# Altium schematic sheet Curiosity_Nano_Base_for_Clicks.SchDoc: Curiosity Nano Base for Click boards
size A3; Organization: Microchip Technology Norway; Address1: Brøsetvegen 164; Address2: 7069 Trondheim; Address3: NORWAY; SheetNumber: 2; SheetTotal: 3; DrawnBy: M. Loper/T.Frostad; PageSetup: Record=PageOptions|CenterHorizontal=True|CenterVertical=True|PrintScale=1.01|XCorrection=1.00|YCorrection=1.00|PrintKind=1|BorderSize=5000000|LeftOffset=0|BottomOffset=0|Orientation=2|PaperLength=1000|PaperWidth=1000|Scale=100|PaperSource=7|PrintQuality=-4|MediaType=1|DitherType=10|PaperKind=A3 (297 x 420 mm)|PrintScaleMode=1; ProjectTitle: Curiosity Nano Base for Click boards
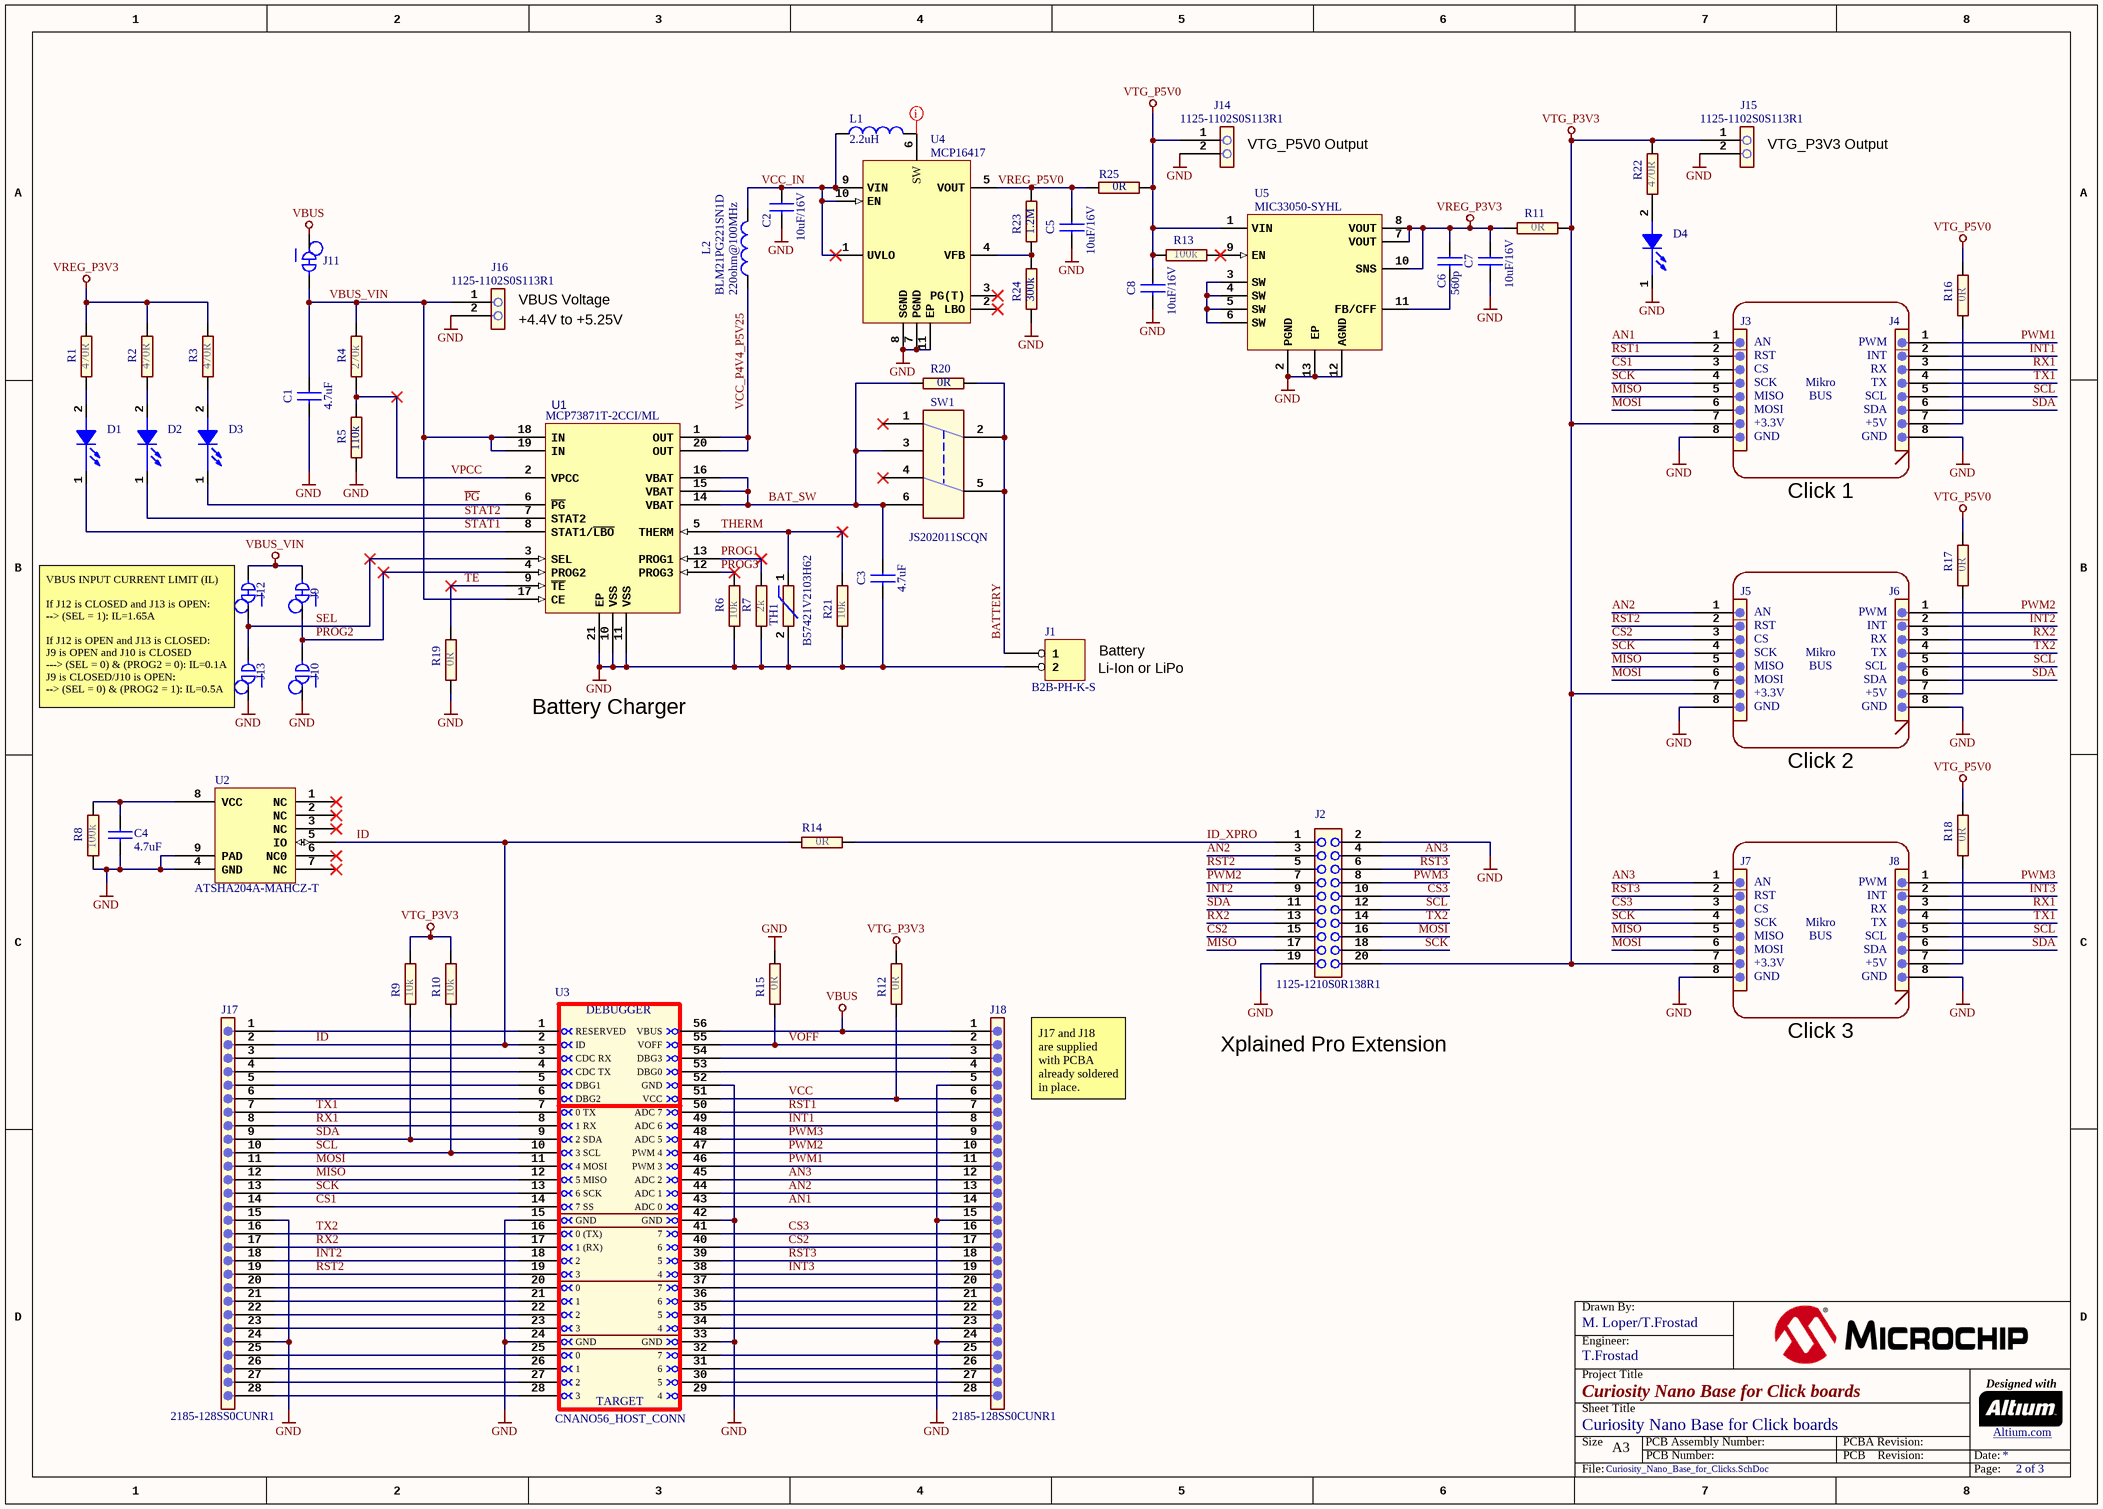
[diagram p0: Curiosity_Nano_Base_for_Clicks.SchDoc]

## Parts
C1  value 4.7uF  [AP1-00069]
C2  value 10uF/16V  [AP1-00039]
C3  value 4.7uF  [AP1-00069]
C4  value 4.7uF  [AP1-00069]
C5  value 10uF/16V  [AP1-00039]
C6  value 560p  [AP1-00002]
C7  value 10uF/16V  [AP1-00039]
C8  value 10uF/16V  [AP1-00039]
D1  (no value)  [AP4-00017]
D2  Farnell no. 1652078  [AP4-00017]  (value not drawn)
D3  Farnell no. 1652078  [AP4-00017]  (value not drawn)
D4  Farnell no. 1652078  [AP4-00017]  (value not drawn)
J1  value B2B-PH-K-S  [AP8-01010]
J2  value 1125-1210S0R138R1  [AP8-01078]
J3  (no value)  [AP8-01081]
J4  (no value)  [AP8-01081]
J5  (no value)  [AP8-01081]
J6  (no value)  [AP8-01081]
J7  (no value)  [AP8-01081]
J8  (no value)  [AP8-01081]
J9  (no value)  [AP9-00044]  (net tie, no BOM)
J10  (no value)  [AP9-00043]  (net tie, no BOM)
J11  (no value)  [AP9-00044]  (net tie, no BOM)
J12  (no value)  [AP9-00044]  (net tie, no BOM)
J13  (no value)  [AP9-00043]  (net tie, no BOM)
J14  value 1125-1102S0S113R1  [AP8-01074]
J15  value 1125-1102S0S113R1  [AP8-01074]
J16  value 1125-1102S0S113R1  [AP8-01074]
J17  value 2185-128SS0CUNR1  [AP8-01199]
J18  value 2185-128SS0CUNR1  [AP8-01199]
L1  value 2.2uH  [AP3-00165]
L2  value 220ohm@100MHz  MPN: BLM21PG221SN1D  [AP3-00104]
R1  value 470R  [AP2-00000]
R2  value 470R  [AP2-00000]
R3  value 470R  [AP2-00000]
R4  value 270k  [AP2-00000]
R5  value 110k  [AP2-00000]
R6  value 10k  [AP2-00000]
R7  value 2k  [AP2-00000]
R8  value 100k  [AP2-00000]
R9  value 10k  [AP2-00000]
R10  value 10k  [AP2-00000]
R11  value 0R  [AP2-00000]
R12  value 0R  [AP2-00000]
R13  value 100k  [AP2-00000]
R14  value 0R  [AP2-00000]
R15  value 0R  [AP2-00000]
R16  value 0R  [AP2-00000]
R17  value 0R  [AP2-00000]
R18  value 0R  [AP2-00000]
R19  value 0R  [AP2-00000]
R20  value 0R  [AP2-00001]
R21  value 10k  [AP2-00000]
R22  value 470R  [AP2-00000]
R23  value 1.2M  [AP2-00011]
R24  value 300k  [AP2-00011]
R25  value 0R  [AP3-00104]
SILK1  (no value)  [AP9-00167]
SILK2  (no value)  [AP9-00167]
SILK3  (no value)  [AP9-00167]
SW1  value JS202011SCQN  [AP8-00684]
TH1  MPN: B57421V2103H62  [AP2-00034]
U1  MPN: MCP73871T-2CCI/ML  [AP6-00165]
U2  MPN: ATSHA204A-MAHCZ-T  [AP6-00409]
U3  value CNANO56_HOST_CONN  [AP8-01154]  (no BOM)
U4  value MCP16417  [AP6-00560]
U5  value MIC33050-SYHL  [AP6-00528]

## Nets
GND: C1.2 C2.2 C3.2 C4.2 C5.2 C7.2 C8.2 D4.1(CATHODE) J1.2 J2.2 J2.19 J3.8 J4.8 J5.8 J6.8 J7.8 J8.8 J10.1 J13.1 J14.2 J15.2 J16.2 J17.15 J17.24 J18.5 J18.15 J18.24 R5.1 R6.2 R7.2 R8.2 R15.2 R19.2 R21.2 R24.1 TH1.2 U1.10(VSS) U1.11(VSS) U1.21(EP) U2.4(GND) U2.9(PAD) U3.0(GND) U3.15(GND) U3.24(GND) U3.33(GND) U3.42(GND) U3.52(GND) U4.7(PGND) U4.8(SGND) U4.11(EP) U5.2(PGND) U5.12(AGND) U5.13(EP)
VBUS: J11.1 J18.1 U3.56(VBUS)
VBUS_VIN: C1.1 J9.2 J11.2 J12.2 J16.1 R4.1 U1.17(CE) U1.18(IN) U1.19(IN)
VREG_P3V3: C6.1 C7.1 R1.1 R2.1 R3.1 R11.2 U5.7(VOUT) U5.8(VOUT) U5.10(SNS)
VTG_P3V3: J2.20 J3.7 J5.7 J7.7 J15.1 R9.1 R10.1 R11.1 R12.2 R22.1
VTG_P5V0: C8.1 J14.1 R13.1 R16.1 R17.1 R18.1 R25.2 U5.1(VIN)
AN1: J3.1 J18.14 U3.43(ADC_0)
AN2: J2.3 J5.1 J18.13 U3.44(ADC_1)
AN3: J2.4 J7.1 J18.12 U3.45(ADC_2)
BAT_SW: C3.1 R20.1 SW1.3(NC2) SW1.6(NC1) U1.14(VBAT) U1.15(VBAT) U1.16(VBAT)
BATTERY: J1.1 R20.2 SW1.2(COMMON2) SW1.5(COMMON1)
CS1: J3.3 J17.14 U3.14(7_SS)
CS2: J2.15 J5.3 J18.17 U3.40(6)
CS3: J2.10 J7.3 J18.16 U3.41(7)
ID: J17.2 R14.1 U2.5(IO) U3.2(ID)
ID_XPRO: J2.1 R14.2
INT1: J4.2 J18.8 U3.49(ADC_6)
INT2: J2.9 J6.2 J17.18 U3.18(2)
INT3: J8.2 J18.19 U3.38(4)
MISO: J2.17 J3.5 J5.5 J7.5 J17.12 U3.12(5_MISO)
MOSI: J2.16 J3.6 J5.6 J7.6 J17.11 U3.11(4_MOSI)
~{PG}: D3.1(CATHODE) U1.6(~{PG})
PROG1: R7.1 U1.13(PROG1)
PROG2: J9.1 J10.2 U1.4(PROG2)
PROG3: R6.1 U1.12(PROG3)
PWM1: J4.1 J18.11 U3.46(PWM_3)
PWM2: J2.7 J6.1 J18.10 U3.47(PWM_4)
PWM3: J2.8 J8.1 J18.9 U3.48(ADC_5)
RST1: J3.2 J18.7 U3.50(ADC_7)
RST2: J2.5 J5.2 J17.19 U3.19(3)
RST3: J2.6 J7.2 J18.18 U3.39(5)
RX1: J4.3 J8.3 J17.8 U3.8(1_RX)
RX2: J2.13 J6.3 J17.17 U3.17(1_(RX))
SCK: J2.18 J3.4 J5.4 J7.4 J17.13 U3.13(6_SCK)
SCL: J2.12 J4.5 J6.5 J8.5 J17.10 R10.2 U3.10(3_SCL)
SDA: J2.11 J4.6 J6.6 J8.6 J17.9 R9.2 U3.9(2_SDA)
SEL: J12.1 J13.2 U1.3(SEL)
STAT1: D1.1(CATHODE) U1.8(STAT1/~{LBO})
STAT2: D2.1(CATHODE) U1.7(STAT2)
~{TE}: R19.1 U1.9(~{TE})
THERM: R21.1 TH1.1 U1.5(THERM)
TX1: J4.4 J8.4 J17.7 U3.7(0_TX)
TX2: J2.14 J6.4 J17.16 U3.16(0_(TX))
VCC: J18.6 R12.1 U3.51(VCC)
VCC_IN: C2.1 L1.1 L2.2 U4.1(UVLO) U4.9(VIN) U4.10(EN)
VCC_P4V4_P5V25: L2.1 U1.1(OUT) U1.20(OUT)
VOFF: J18.2 R15.1 U3.55(VOFF)
VPCC: R4.2 R5.2 U1.2(VPCC)
VREG_P5V0: C5.1 R23.2 R25.1 U4.5(VOUT)
NetC4_1: C4.1 R8.1 U2.8(VCC)
NetC6_2: C6.2 U5.11(FB/CFF)
NetD1_2: D1.2(ANODE) R1.2
NetD2_2: D2.2(ANODE) R2.2
NetD3_2: D3.2(ANODE) R3.2
NetD4_2: D4.2(ANODE) R22.2
NetJ4_7: J4.7 R16.2
NetJ6_7: J6.7 R17.2
NetJ8_7: J8.7 R18.2
NetJ17_1: J17.1 U3.1(RESERVED)
NetJ17_3: J17.3 U3.3(CDC_RX)
NetJ17_4: J17.4 U3.4(CDC_TX)
NetJ17_5: J17.5 U3.5(DBG1)
NetJ17_6: J17.6 U3.6(DBG2)
NetJ17_20: J17.20 U3.20(0)
NetJ17_21: J17.21 U3.21(1)
NetJ17_22: J17.22 U3.22(2)
NetJ17_23: J17.23 U3.23(3)
NetJ17_25: J17.25 U3.25(0)
NetJ17_26: J17.26 U3.26(1)
NetJ17_27: J17.27 U3.27(2)
NetJ17_28: J17.28 U3.28(3)
NetJ18_3: J18.3 U3.54(DBG3)
NetJ18_4: J18.4 U3.53(DBG0)
NetJ18_20: J18.20 U3.37(7)
NetJ18_21: J18.21 U3.36(6)
NetJ18_22: J18.22 U3.35(5)
NetJ18_23: J18.23 U3.34(4)
NetJ18_25: J18.25 U3.32(7)
NetJ18_26: J18.26 U3.31(6)
NetJ18_27: J18.27 U3.30(5)
NetJ18_28: J18.28 U3.29(4)
NetL1_2: L1.2 U4.6(SW)
NetR13_2: R13.2 U5.9(EN)
NetR23_1: R23.1 R24.2 U4.4(VFB)
NetU5_3: U5.3(SW) U5.4(SW) U5.5(SW) U5.6(SW)

Not connected (* = marked no-connect by the designer): SW1 1(NO2)* 4(NO1)*; U2 1(NC)* 2(NC)* 3(NC)* 6(NC0)* 7(NC)*; U4 2(LBO)* 3(PG(T))*

## Layout directives
rule Assembly Testpoint Usage [Testpoint - Not Allowed    Multiple - Not Allowed]: NetL1_2

## Notes on the sheet
- (near J14) VTG_P5V0 Output
- (near J15) VTG_P3V3 Output
- (near J16) VBUS Voltage
- (near J16) +4.4V to +5.25V
- Click 1
- VBUS INPUT CURRENT LIMIT (IL)
  If J12 is CLOSED and J13 is OPEN:
  --> (SEL = 1): IL=1.65A
  If J12 is OPEN and J13 is CLOSED:
  J9 is OPEN and J10 is CLOSED
  ---> (SEL = 0) & (PROG2 = 0): IL=0.1A
  J9 is CLOSED/J10 is OPEN:
  --> (SEL = 0) & (PROG2 = 1): IL=0.5A
- Battery Charger
- (near J1) Li-Ion or LiPo
- Battery
- Click 2
- Xplained Pro Extension
- Click 3
- (near J18) J17 and J18
  are supplied
  with PCBA
  already soldered
  in place.
- Drawn By:
- Project Title
- Engineer:
- T.Frostad
- Designed with
- Sheet Title
- Size
- A3
- PCB Number:
- PCB Assembly Number:
- PCBA Revision:
- PCB    Revision:
- Date:
- Altium.com <http://go.altium.com/MicrochipLandingPage_Evaluation.html>
- File:
- Page:
- (in symbol A08-2847) AN; PWM; RST; INT; CS; RX; SCK; Mikro; TX; MISO; BUS; SCL; MOSI; SDA; +3.3V; +5V; GND
- (in symbol A08-2940) DEBUGGER; TARGET

## Library data of the parts
C1 C3 C4 = A01-0486: Ceramic capacitor, SMD 0805, X7R, 16V, 10%,; PartGroup: Capacitors,Ceramic,SMD 0805; Manufacturer: Yageo; MPN: CC0805KKX7R7BB475; TemperatureRange: -55 to +125 deg C; AN: A01-0486; Tolerance: 10%
C2 C5 C7 C8 = A01-0491: Ceramic capacitor, SMD 0603, X5R, 16V, 10UF ± 20% (High Density); PartGroup: Capacitors,Ceramic,SMD 0603; Manufacturer: Taiyo Yuden; MPN: EMK107BBJ106MA-T; Tolerance: ­± 20%; TemperatureRange: -55°C to +85°C; AN: A01-0491; Height: 0.819999992847443
C6 = A01-0098: Ceramic capacitor, SMD 0603, X7R, 50V, ±10 %; PartGroup: Capacitors,Ceramic,SMD 0603; TemperatureRange: -55 - +125 deg C; AN: A01-0098; Tolerance: 50V, ±10 %; Height: 0.899999976158142
D1 = A10-0217: LED, SMD 0603, Red, Wave length=620nm, 63mcd @ (20mA, 2.2Vf) rohm; PartGroup: Opto,LEDs,SMD; MPN: SML-D12U1WT86; Value: RED LED; TemperatureRange: -40 to +85; AN: A10-0217; Height: 0.550000011920929; Manufacturer: ROHM
D2-D4 = A10-0056: LED, Green, 570nm, SMD 0603; PartGroup: Opto,LEDs,SMD; Manufacturer: ROHM; Value: SML-310MTT86N; TemperatureRange: -30; AN: A10-0056; Height: 0.449999988079071; MPN: SML-310MTT86N
J1 = A08-2593: Pin Header 1x2, 2mm THM, top entry, 100V AC/DC, 2A AC/DC (AWG #24); PartGroup: Mechanical devices,Connectors,Pin headers; Manufacturer: J.S.T. Mfg. Co. Ltd.; AN: A08-2593; Height: 6; MPN: B2B-PH-K-S
J2 = A08-2786: Pin header, 2x10, Right Angle, 2.54mm, THM, Pin In Paste; PartGroup: Mechanical devices,Connectors,Pin headers; Manufacturer: WCON; MPN: 1125-1210S0R138CR01; AN: A08-2786; Height: 5.15000009536743
J3-J8 = A08-2791: 1x8 receptacle pin header, 2.54mm pitch THM, PIP; PartGroup: Mechanical devices,Connectors,Pin header receptacle; Manufacturer: WCON; Value: 2185-108SS0CYNP1; AN: A08-2791; Height: 8.64999961853027; MPN: 2185-108SS0CYNP1
J9 J11 J12 = A09-0783: Default closed SMD strap, 0603 size; PartGroup: Mechanical devices,PCB implemented components; Value: SMD-STRAP_0603_CLOSED; AN: A09-0783; Height: 0
J10 J13 = A09-0784: Default open SMD strap, 0603 size; PartGroup: Mechanical devices,PCB implemented components; Value: SMD-STRAP_0603_OPEN; AN: A09-0784; Height: 0
J14-J16 = A08-2782: 1x2 pin header, 2.54mm pitch, Pin-in-Paste THM; PartGroup: Mechanical devices,Connectors,Pin headers; Manufacturer: WCON; TemperatureRange: -40Â°C to +105Â°C; AN: A08-2782; Height: 9; MPN: 1125-1102S0S113R1
J17 J18 = A08-3092: 1X28 Receptacle Pin Socket 2.54mm pitch THM with pick and place TAB; PartGroup: Mechanical devices,Connectors,Pin header receptacle; Manufacturer: WCON; AN: A08-3092; Height: 9; MPN: 2185-128SS0CUNR1
L1 = A03-0347: 2.2uH, 2.6A shielded SMD power inductor; PartGroup: Inductors,Power Inductors; Manufacturer: Murata; MPN: DFE252012P-2R2M=P2; TemperatureRange: -40 to +125 deg C; AN: A03-0347; Height: 1.20000004768372
L2 = A03-0179: FerriteBead,220ohm@100MHz,2000mA,0.045ohm; PartGroup: Inductors,EMI; Manufacturer: Murata; Tolerance: Â±25%; TemperatureRange: -55 Â°C to +125 Â°C; AN: A03-0179; Height: 0.850000023841858
R1-R3 R22 = A02-0204: Thick film resistor, SMD 0402, 1/16W, 1%; PartGroup: Resistors,SMD,0402 1%; Manufacturer: ASJ Holdings; MPN: CR10-4700-FK; TemperatureRange: -55 - +125 deg C; AN: A02-0204; Tolerance: 1 %; Height: 0.349999994039536
R4 = A02-0270: Thick film resistor, SMD 0402, 1/16W, 1%; PartGroup: Resistors,SMD,0402 1%; Manufacturer: Yageo; MPN: RC0402FR07270KL; TemperatureRange: -55 - +125 deg C; AN: A02-0270; Tolerance: 1 %; Height: 0.349999994039536
R5 = A02-0261: Thick film resistor, SMD 0402, 1/16W, 1%; PartGroup: Resistors,SMD,0402 1%; Manufacturer: Yageo; MPN: RC0402FR-07110KL; TemperatureRange: -55ï¿½ to +125ï¿½C; AN: A02-0261; Tolerance: 1 %; Height: 0.349999994039536
R6 R9 R10 R21 = A02-0236: Thick film resistor, SMD 0402, 1/16W, 1%; PartGroup: Resistors,SMD,0402 1%; Manufacturer: vishay; MPN: CRCW040210K0FKED; TemperatureRange: -55 - +125 deg C; AN: A02-0236; Tolerance: 1 %; Height: 0.349999994039536
R7 = A02-0219: Thick film resistor, SMD 0402, 1/16W, 1%; PartGroup: Resistors,SMD,0402 1%; Manufacturer: Yageo; MPN: RC0402FR072KL; TemperatureRange: -55 - +125 deg C; AN: A02-0219; Tolerance: 1 %; Height: 0.349999994039536
R8 R13 = A02-0260: Thick film resistor, SMD 0402, 1/16W, 1%; PartGroup: Resistors,SMD,0402 1%; Manufacturer: Yageo; MPN: RC0402FR-07100KP; TemperatureRange: -55ï¿½ to +125ï¿½C; AN: A02-0260; Tolerance: 1 %; Height: 0.349999994039536
R11 R12 R14-R19 = A02-0163: RES 0.0 OHM 1/16W 0402 SMD; PartGroup: Resistors,SMD,0402 1%; Manufacturer: Stackpole Electronics Inc; MPN: RMCF0402ZT0R00; Tolerance: 1 %; TemperatureRange: -55 - +125 deg C; AN: A02-0163; Height: 0.349999994039536
R20 = A02-0001: Thick film resistor, SMD 0603, 1/10W, 1%; PartGroup: Resistors,SMD,0603 1%; Manufacturer: Panasonic; MPN: ERJ-3GEY0R00V; AN: A02-0001; Tolerance: 1 %; Height: 0.5
R23 = A02-0670: Thick film resistor, SMD 0402, 1/16W, 1%; PartGroup: Resistors,SMD,0402 1%; Manufacturer: Yageo; MPN: RC0402FR-071M2L; TemperatureRange: -55 - +125 deg C; AN: A02-0670; Tolerance: 1%; Height: 0.349999994039536
R24 = A02-1015: Thick film resistror, SMD 0402, 1/16W, 1%; PartGroup: Resistors,SMD,0402 1%; Manufacturer: Yageo; MPN: RC0402FR-07300KL; TemperatureRange: -55 to +155 deg C; AN: A02-1015; Tolerance: 1%; Height: 0.349999994039536
R25 = A02-0852: Chip Resistor 0R,0805,1% 1/8W; PartGroup: Resistors,SMD,0805 1%; Manufacturer: Yageo; MPN: RC0805FR-070RL; Tolerance: Â±1%; TemperatureRange: â€“55 Â°C to +155 Â°C; AN: A02-0852; Height: 0.5
SILK1-SILK3 = A08-2847: Full standard silkscreen for MikroBUS socket. Derived from component files distributed by MikroElektronika. Can be deviated from in case of space requirements, etc. If so, refer to spec.; PartGroup: Mechanical devices,PCB implemented components,PCB Graphics; Value: MikroBUS_socket_silkscreen_full; AN: A08-2847; Height: 0
SW1 = A08-1643: Slide Switch, C&K, 2 Pos 2 Pol, SMD; PartGroup: Mechanical devices,Switches,SMD; Manufacturer: C&K Components; AN: A08-1643; Height: 5.5; MPN: JS202011SCQN
TH1 = A02-0936: THERMISTOR NTC 10K OHM 3% 0805; PartGroup: Resistors,Thermistors,SMD NTC; Manufacturer: EPCOS; Value: NTC- B57421V2103H62; Tolerance: +-5%; TemperatureRange: -55C to +125C; AN: A02-0936
U1 = A06-1643: Load Sharing and Li-Ion/Li-Polymer Battery Charge Management Controller; Manufacturer: Microchip; PartGroup: Integrated Circuits,Regulators,Switched; Value: MCP73871; TemperatureRange: -40Â°C to  +85Â°C; AN: A06-1643; Height: 1
U2 = A06-1276: ATSHA204A with 1-wire interface and UDFN8 package; PartGroup: Integrated Circuits,Special function,Encryption; Manufacturer: Microchip; Value: ATSHA204A SWI UDFN8; AN: A06-1276; Height: 0.600000023841858
U3 = A08-2940: 56-pin Header HOST (for CNANO solder mounting); PartGroup: Mechanical devices,Connectors,Pin headers; AN: A08-2940
U4 = A06-1770: Low Iq boost converter with programmable low battery, UVLO, and automatic input-to-output bypass operation; PartGroup: Integrated Circuits,Regulators,Switched; Manufacturer: Microchip; MPN: MCP16417T-I/MN; TemperatureRange: -40 to +125; AN: A06-1770; Height: 0.800000011920929
U5 = A06-1644: 3.3V Fixed, 4MHz, 600mA, Buck regulator with internal inductor with HyperLight Load; PartGroup: Integrated Circuits,Regulators,Switched; Manufacturer: Microchip; MPN: MIC33050-SYHL-TR; TemperatureRange: -40C to +125C; AN: A06-1644